# Altium schematic sheet BFMC_Microcontrollers.SchDoc
size A; SheetNumber: 5; SheetTotal: 7
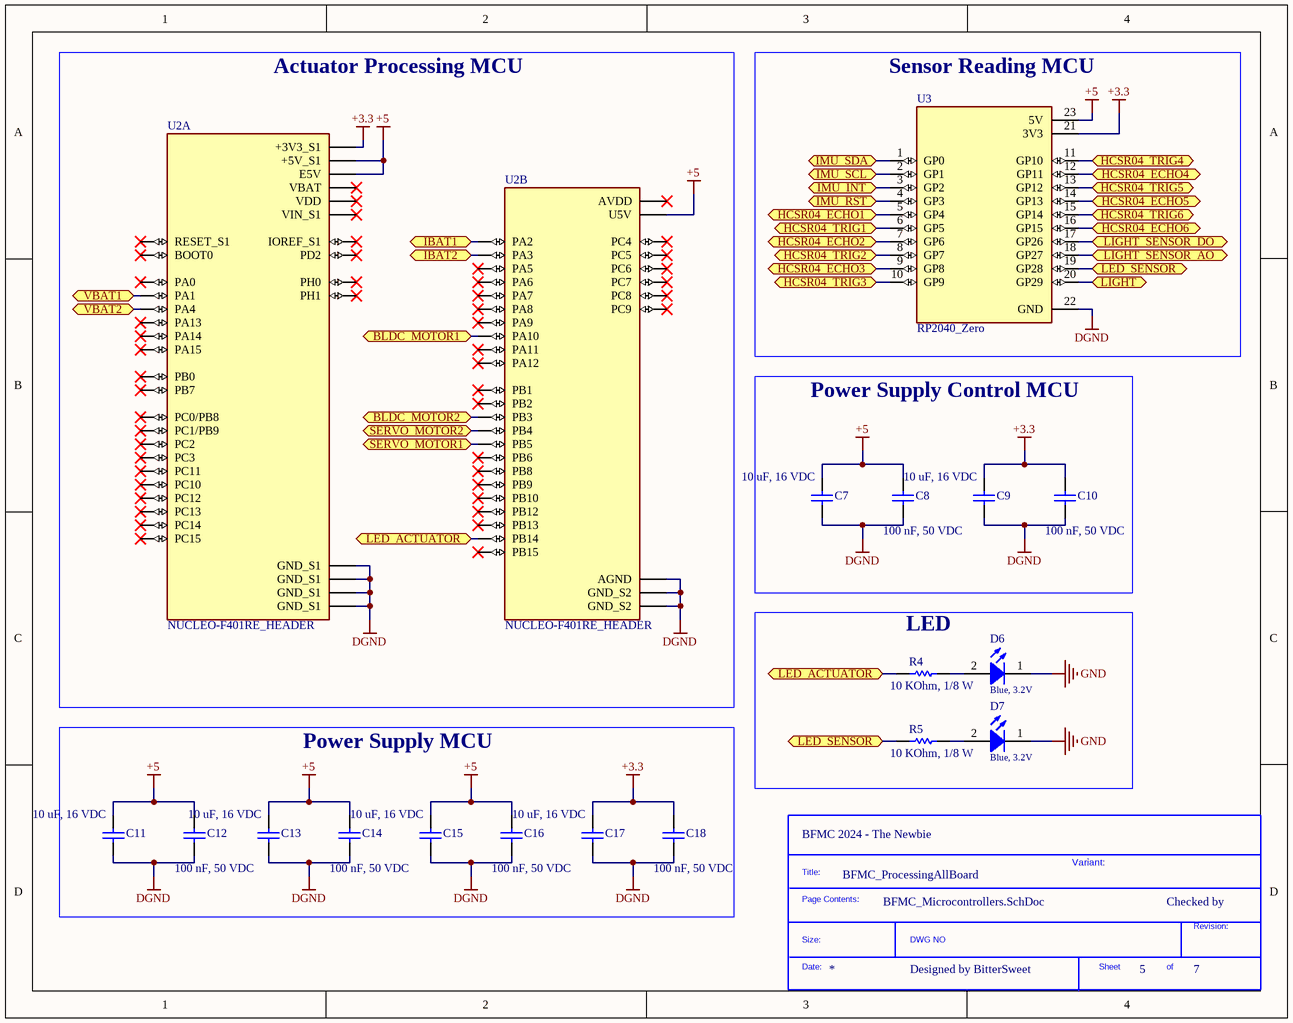
[diagram p0: BFMC_Microcontrollers.SchDoc]

## Parts
*?  SDTitleBlock  (value not drawn)  (graphical)
C7  10 uF, 16 VDC  [CAP_0805]
C8  100 nF, 50 VDC  [CAP_0805]
C9  10 uF, 16 VDC  [CAP_0805]
C10  100 nF, 50 VDC  [CAP_0805]
C11  10 uF, 16 VDC  [CAP_0805]
C12  100 nF, 50 VDC  [CAP_0805]
C13  10 uF, 16 VDC  [CAP_0805]
C14  100 nF, 50 VDC  [CAP_0805]
C15  10 uF, 16 VDC  [CAP_0805]
C16  100 nF, 50 VDC  [CAP_0805]
C17  10 uF, 16 VDC  [CAP_0805]
C18  100 nF, 50 VDC  [CAP_0805]
D6  Blue, 3.2V  [WL-SMCW_0805]
D7  Blue, 3.2V  [WL-SMCW_0805]
R4  10 KOhm, 1/8 W  [RESISTOR_0805]
R5  10 KOhm, 1/8 W  [RESISTOR_0805]
U2  NUCLEO-F401RE_HEADER  [NUCLEO-F401RE-HEADER]  (parts A,B of 2)
U3  RP2040_Zero  [RP2040_ZERO]

## Blocks framed on the sheet
Actuator Processing MCU: U2
Sensor Reading MCU: U3
Power Supply Control MCU: C7-C10
LED: D6 D7 R4 R5
Power Supply MCU: C11-C18

## Ports
BLDC_MOTOR1 (bidir), BLDC_MOTOR2 (bidir), HCSR04_ECHO1 (bidir), HCSR04_ECHO2 (bidir), HCSR04_ECHO3 (bidir), HCSR04_ECHO4 (bidir), HCSR04_ECHO5 (bidir), HCSR04_ECHO6 (bidir), HCSR04_TRIG1 (bidir), HCSR04_TRIG2 (bidir), HCSR04_TRIG3 (bidir), HCSR04_TRIG4 (bidir), HCSR04_TRIG5 (bidir), HCSR04_TRIG6 (bidir), IBAT1 (bidir), IBAT2 (bidir), IMU_INT (bidir), IMU_RST (bidir), IMU_SCL (bidir), IMU_SDA (bidir), LED_ACTUATOR (bidir), LED_SENSOR (bidir), LIGHT (bidir), LIGHT_SENSOR_AO (bidir), LIGHT_SENSOR_DO (bidir), SERVO_MOTOR1 (bidir), SERVO_MOTOR2 (bidir), VBAT1 (bidir), VBAT2 (bidir)

## Nets
+3.3: C9.2 C10.2 C17.2 C18.2 U2.CN7_16(+3V3_S1) U3.21(3V3)
+5: C7.2 C8.2 C11.2 C12.2 C13.2 C14.2 C15.2 C16.2 U2.CN7_6(E5V) U2.CN7_18(+5V_S1) U2.CN10_8(U5V) U3.23(5V)
DGND: C7.1 C8.1 C9.1 C10.1 C11.1 C12.1 C13.1 C14.1 C15.1 C16.1 C17.1 C18.1 U2.CN7_8(GND_S1) U2.CN7_19(GND_S1) U2.CN7_20(GND_S1) U2.CN7_22(GND_S1) U2.CN10_9(GND_S2) U2.CN10_20(GND_S2) U2.CN10_32(AGND) U3.22(GND)
GND: D6.1(K) D7.1(K)
BLDC_MOTOR1: U2.CN10_33(PA10) ; port BLDC_MOTOR1
BLDC_MOTOR2: U2.CN10_31(PB3) ; port BLDC_MOTOR2
HCSR04_ECHO1: U3.5(GP4) ; port HCSR04_ECHO1
HCSR04_ECHO2: U3.7(GP6) ; port HCSR04_ECHO2
HCSR04_ECHO3: U3.9(GP8) ; port HCSR04_ECHO3
HCSR04_ECHO4: U3.12(GP11) ; port HCSR04_ECHO4
HCSR04_ECHO5: U3.14(GP13) ; port HCSR04_ECHO5
HCSR04_ECHO6: U3.16(GP15) ; port HCSR04_ECHO6
HCSR04_TRIG1: U3.6(GP5) ; port HCSR04_TRIG1
HCSR04_TRIG2: U3.8(GP7) ; port HCSR04_TRIG2
HCSR04_TRIG3: U3.10(GP9) ; port HCSR04_TRIG3
HCSR04_TRIG4: U3.11(GP10) ; port HCSR04_TRIG4
HCSR04_TRIG5: U3.13(GP12) ; port HCSR04_TRIG5
HCSR04_TRIG6: U3.15(GP14) ; port HCSR04_TRIG6
IBAT1: U2.CN10_35(PA2) ; port IBAT1
IBAT2: U2.CN10_37(PA3) ; port IBAT2
IMU_INT: U3.3(GP2) ; port IMU_INT
IMU_RST: U3.4(GP3) ; port IMU_RST
IMU_SCL: U3.2(GP1) ; port IMU_SCL
IMU_SDA: U3.1(GP0) ; port IMU_SDA
LED_ACTUATOR: R4.1 U2.CN10_28(PB14) ; port LED_ACTUATOR
LED_SENSOR: R5.1 U3.19(GP28) ; port LED_SENSOR
LIGHT: U3.20(GP29) ; port LIGHT
LIGHT_SENSOR_AO: U3.18(GP27) ; port LIGHT_SENSOR_AO
LIGHT_SENSOR_DO: U3.17(GP26) ; port LIGHT_SENSOR_DO
SERVO_MOTOR1: U2.CN10_29(PB5) ; port SERVO_MOTOR1
SERVO_MOTOR2: U2.CN10_27(PB4) ; port SERVO_MOTOR2
VBAT1: U2.CN7_30(PA1) ; port VBAT1
VBAT2: U2.CN7_32(PA4) ; port VBAT2
NetD6_2: D6.2(A) R4.2
NetD7_2: D7.2(A) R5.2

Not connected (* = marked no-connect by the designer): U2 CN7_1(PC10)* CN7_2(PC11)* CN7_3(PC12)* CN7_4(PD2)* CN7_5(VDD)* CN7_7(BOOT0)* CN7_12(IOREF_S1)* CN7_13(PA13)* CN7_14(RESET_S1)* CN7_15(PA14)* CN7_17(PA15)* CN7_21(PB7)* CN7_23(PC13)* CN7_24(VIN_S1)* CN7_25(PC14)* CN7_27(PC15)* CN7_28(PA0)* CN7_29(PH0)* CN7_31(PH1)* CN7_33(VBAT)* CN7_34(PB0)* CN7_35(PC2)* CN7_36(PC1/PB9)* CN7_37(PC3)* CN7_38(PC0/PB8)* CN10_1(PC9)* CN10_2(PC8)* CN10_3(PB8)* CN10_4(PC6)* CN10_5(PB9)* CN10_6(PC5)* CN10_7(AVDD)* CN10_11(PA5)* CN10_12(PA12)* CN10_13(PA6)* CN10_14(PA11)* CN10_15(PA7)* CN10_16(PB12)* CN10_17(PB6)* CN10_19(PC7)* CN10_21(PA9)* CN10_22(PB2)* CN10_23(PA8)* CN10_24(PB1)* CN10_25(PB10)* CN10_26(PB15)* CN10_30(PB13)* CN10_34(PC4)*

## Notes on the sheet
- (near *?) BFMC 2024 - The Newbie
- BFMC_ProcessingAllBoard
- Variant:
- Checked by
- Designed by BitterSweet
- (in symbol SDTitleBlock) Title:; Page Contents:; Revision:; Size:; DWG NO; Date:; Sheet; of

## Library data of the parts
C7 C9 C11 C13 C15 C17 = 0108051061016: CAP, size 0805, 10 uF, 16 VDC; Manufacture Name: TDK; Manufacture SN: CGA4J1X7S1C106K125AE; Capacitance: 10 uF; Tolerance: +/-10%; Voltage Rating DC: 16 VDC; ComponentLink2Description: Datasheet; ComponentLink2URL: https://product.tdk.com/system/files/dam/doc/product/capacitor/ceramic/mlcc/catalog/mlcc_automotive_soft_en.pdf?ref_disty=mouser; Operating Temperature: -55 to +125degC; Packaging: Tape and Reel; Mounting Technology: SMT; Size: 0805; Supplier 1 Name: Mouser; Supplier 1 SN: 810-CGA4J1X7S1C106KA; Supplier 1 URL: https://www.mouser.vn/ProductDetail/TDK/CGA4J1X7S1C106K125AE?qs=nQSIdc08i%252Bda5YDbrVYncg%3D%3D&utm_source=mouser-refine-download&utm_medium=file&utm_campaign=CGA4J1X7S1C106K125AE&utm_content=TDK; Supplier 2 Name: Digi-Key; Supplier 2 SN: 445-173674-2-ND; Supplier 2 URL: https://www.digikey.com/en/products/detail/tdk-corporation/cga4j1x7s1c106k125ae/5809239; Supplier 3 Name: thegioiic; Supplier 3 SN: OEM; Supplier 3 URL: https://www.thegioiic.com/tu-gom-0805-10uf-16v; Value: 10 uF, 16 VDC
C8 C10 C12 C14 C16 C18 = 0108051031050: CAP, size 0805, 100 nF, 50 VDC; Manufacture Name: TDK; Manufacture SN: CGA4C2C0G1H103J060AA; Capacitance: 100 nF; Tolerance: +/-5%; Voltage Rating DC: 50 VDC; ComponentLink2Description: Datasheet; ComponentLink2URL: https://product.tdk.com/system/files/dam/doc/product/capacitor/ceramic/mlcc/catalog/mlcc_automotive_general_en.pdf?ref_disty=mouser; Operating Temperature: -55 to +125degC; Packaging: Tape and Reel; Mounting Technology: SMT; Size: 0805; Supplier 1 Name: Mouser; Supplier 1 SN: 810-CGA4C2C0G1H103J; Supplier 1 URL: https://www.mouser.vn/ProductDetail/TDK/CGA4C2C0G1H103J060AA?qs=FxQuwy19cyC9M6v0nMqjhA%3D%3D&utm_source=mouser-refine-download&utm_medium=file&utm_campaign=CGA4C2C0G1H103J060AA&utm_content=TDK; Supplier 2 Name: Digi-Key; Supplier 2 SN: 445-6947-2-ND; Supplier 2 URL: https://www.digikey.com/en/products/detail/tdk-corporation/cga4c2c0g1h103j060aa/2672840; Supplier 3 Name: thegioiic; Supplier 3 SN: OEM; Supplier 3 URL: https://www.thegioiic.com/tu-gom-0805-100nf-0-1uf-50v; Value: 100 nF, 50 VDC
D6 D7 = 160805BlueBlur: WL-SMCW SMT Mono-color Chip LED Blur, size 0805, Blue, 3.2V, 140deg; Color: Blue; Size: 0603; Type: Blur; ComponentLink1Description: Datasheet link; ComponentLink1URL: N/A; ComponentLink2Description: Supplier 1 URL; ComponentLink2URL: https://www.mouser.vn/ProductDetail/Broadcom-Avago/HSMR-C170?qs=YDL0qNrpDT75U8LW5zK4Qg%3D%3D; ComponentLink3Description: Supplier 2 URL; ComponentLink3URL: https://www.digikey.com/en/products/detail/broadcom-limited/HSMR-C170/637706; ComponentLink4Description: Supplier 3 URL; ComponentLink4URL: N/A; Supplier 1 Name: Mouser; Supplier 1 SN: 630-HSMR-C170; Supplier 1 URL: https://www.mouser.vn/ProductDetail/Broadcom-Avago/HSMR-C170?qs=YDL0qNrpDT75U8LW5zK4Qg%3D%3D; Supplier 2 Name: Digi-Key; Supplier 2 SN: 516-1445-2-ND; Supplier 2 URL: https://www.digikey.com/en/products/detail/broadcom-limited/HSMR-C170/637706; Supplier 3 Name: ICDayRoi; Supplier 3 SN: N/A; Value: Blue, 3.2V
  D6: Supplier 3 URL: https://www.thegioiic.com/led-trang-0805-dan-smd-trong-suot-harvatek
  D7: Supplier 3 URL: https://www.thegioiic.com/led-xanh-duong-0805-dan-smd-trong-suot-harvatek
R4 R5 = 0008051035: RES, size 0805, 10 KOhm, 1/8 W; Manufacture  Name: Vishay Dale; Manufacture  SN: CRCW080510K0JNEAC; Resistance tolerance: +/-5%; Rated Power: 1/8 W; Resistance: 10 KOhm; Size: 0805; Mounting Technology: SMT; Supplier 1 Name: Mouser; Supplier 1 SN: 71-CRCW080510K0JNEB; Supplier 1 URL: https://www.mouser.vn/ProductDetail/Vishay-Dale/CRCW080510K0JNEB?qs=LOX6nxTstiZ5fn9YUdHx5A%3D%3D; Supplier 2 Name: Digi-Key; Supplier 2 SN: 541-4163-2-ND; Supplier 2 URL: https://www.digikey.com/en/products/detail/vishay-dale/CRCW080510K0JNEAC/7928585; Supplier 3 Name: Thegioiic; Supplier 3 SN: N/A; Supplier 3 URL: https://www.thegioiic.com/dien-tro-10-kohm-0805-1-; Value: 10 KOhm, 1/8 W; ComponentLink1Description: Datasheet link; ComponentLink1URL: https://www.vishay.com/docs/28773/crcwce3.pdf; ComponentLink2Description: Supplier 1 URL; ComponentLink2URL: https://www.mouser.vn/ProductDetail/Vishay-Dale/CRCW080510K0JNEB?qs=LOX6nxTstiZ5fn9YUdHx5A%3D%3D; ComponentLink3Description: Supplier 2 URL; ComponentLink3URL: https://www.digikey.com/en/products/detail/vishay-dale/CRCW080510K0JNEAC/7928585; ComponentLink4Description: Supplier 3 URL; ComponentLink4URL: N/A
U2 = NUCLEO-F401RE_HEADER: STM32 Nucleo-64 development board with STM32F401RET6 MCU, supports Arduino and ST morpho connectivity; Availability: Unavailable; Price: None; Package: None; MP: NUCLEO-F401RE; Value: *
U3 = RP2040_ZERO: RP2040-Zero, A Low-Cost, High-Performance Pico-Like MCU Board Based On Raspberry Pi Microcontroller RP2040